# Altium schematic sheet Power_Supply.SchDoc
size A3; SheetNumber: 3; SheetTotal: 3
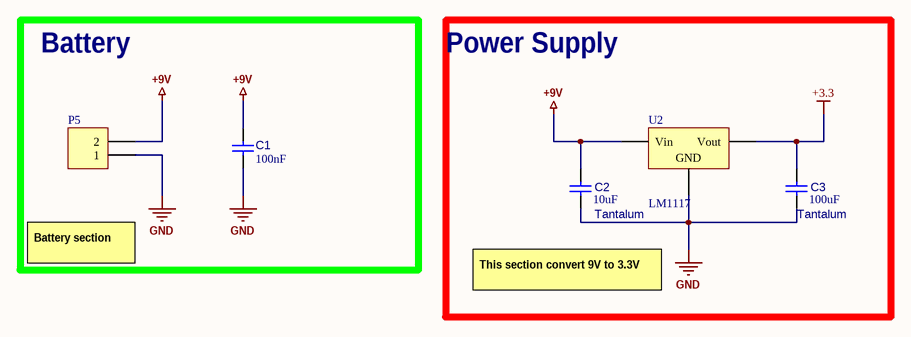
[diagram p0: Power_Supply.SchDoc]

## Parts
C1  value 100nF  [CAPC2013X95X50LL10T25]  (hidden comment: Capacitor 100 nF +/-10% 50 V 0805)
C2  Tantalum  value 10uF  [CAPC2013X95X50LL10T25]
C3  Tantalum  value 100uF  [CAPC2013X95X50LL10T25]
P5  Battery connection  [PHOE-1803277_V]  (value not drawn)
U2  LM1117  [MY_SOT223]

## Blocks framed on the sheet
Battery: C1 P5
Power Supply: C2 C3 U2

## Nets
+3.3: C3.1 U2.2(Vout)
+9V: C1.1 C2.1 P5.2 U2.3(Vin)
GND: C1.2 C2.2 C3.2 P5.1 U2.1(GND)

## Notes on the sheet
- Battery section
- This section convert 9V to 3.3V

## Library data of the parts
C1-C3 = CMP-001-00018-6: Chip Capacitor, 100 nF, +/- 10%, 50 V, 0805 (2012 Metric); Capacitor Type: Ceramic; Voltage Rating: 50V; Pins: 2; Max Operating Temperature: 125°C; Min Operating Temperature: -55°C; Mounting Technology: SM; Case/Package: 0805; RoHS Compliant: True; Tolerance: 10%
P5 = Header 2: Header, 2-Pin; ASiD Part Number: Header 2-AS
U2 = LM1117: Low Drop Voltage Reg; ASiD Part Number: LM1117-AS